# EAGLE design IARC_GR_Shield (EAGLE 6.4)
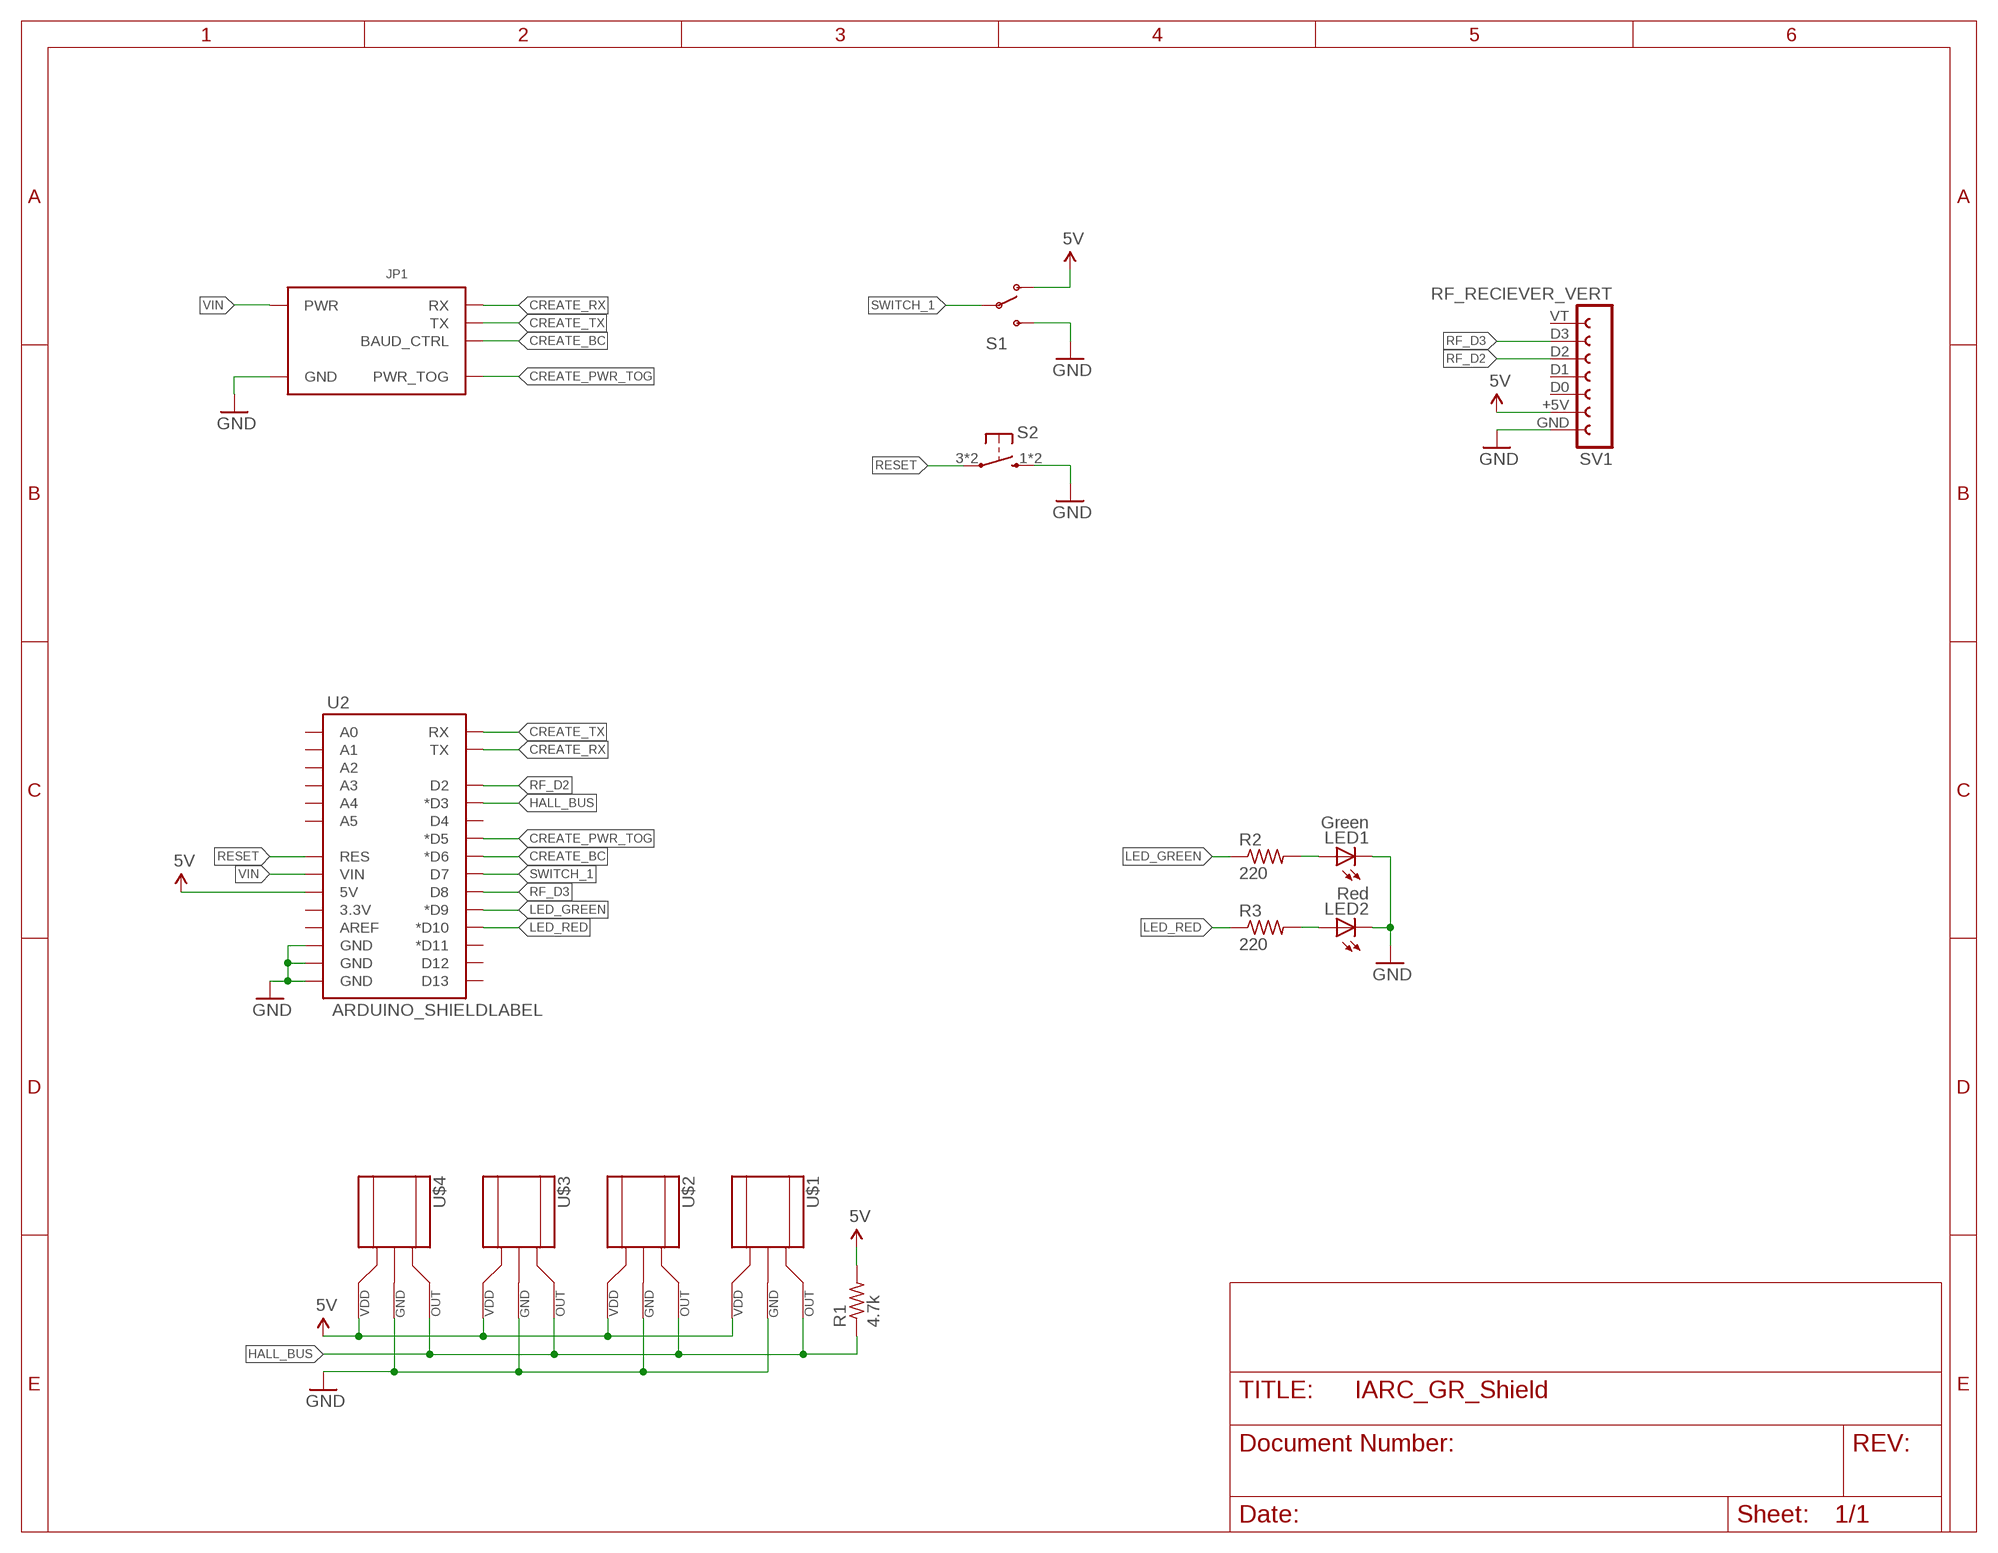
[diagram p0: schematic, sheet 1]

## Parts
JP1  IROBOT_CREATE_IARC_HOOKUP  [2X5-SHROUDED]
LED1  Green  LED5MM  [LED5MM]
LED2  Red  LED5MM  [LED5MM]
R1  4.7k  R-US_0207/10  [0207/10]
R2  220  R-US_0207/10  [0207/10]
R3  220  R-US_0207/10  [0207/10]
S1  SWITCH-SPDTTHRU-VERT  [SWITCH-SPDT_THRU-VERT]
S2  TACT_BUTTON_THRU-HOLE  [SIMPLE_BUTTON]
SV1  RF_RECIEVER_VERT  [RF_RECIEVER_VERT]
U2  ARDUINO_SHIELDLABEL  [DUEMILANOVE_SHIELD]
U$1  HALL_EFFECTHEADER  [1X03]
U$2  HALL_EFFECTHEADER  [1X03]
U$3  HALL_EFFECTHEADER  [1X03]
U$4  HALL_EFFECTHEADER  [1X03]

## Nets
5V: R1.2 S1.1(O) SV1.+5V U2.5V U$1.1(VDD) U$2.1(VDD) U$3.1(VDD) U$4.1(VDD)
CREATE_BC: JP1.3(BAUD_CTRL) U2.D6(*D6)
CREATE_PWR_TOG: JP1.5(PWR_TOG) U2.D5(*D5)
CREATE_RX: JP1.4(RX) U2.TX
CREATE_TX: JP1.1(TX) U2.RX
GND: JP1.2(GND) LED1.K(C) LED2.K(C) S1.3(S) S2.1(S) S2.2(S) SV1.GND U2.GND@0(GND) U2.GND@1(GND) U2.GND@2(GND) U$1.2(GND) U$2.2(GND) U$3.2(GND) U$4.2(GND)
HALL_BUS: R1.1 U2.D3(*D3) U$1.3(OUT) U$2.3(OUT) U$3.3(OUT) U$4.3(OUT)
LED_GREEN: R2.1 U2.D9(*D9)
LED_RED: R3.1 U2.D10(*D10)
N$1: LED1.A R2.2
N$2: LED2.A R3.2
RESET: S2.3(P) S2.4(P) U2.RES
RF_D2: SV1.D2 U2.D2
RF_D3: SV1.D3 U2.D8
SWITCH_1: S1.2(P) U2.D7
VIN: JP1.6(PWR) U2.VIN
Unconnected: SV1.D0 SV1.D1 SV1.VT U2.3.3V U2.A0 U2.A1 U2.A2 U2.A3 U2.A4 U2.A5 U2.AREF U2.D4 U2.D11(*D11) U2.D12 U2.D13

## Library data of the parts
JP1 = MAAV_Roomba:IROBOT_CREATE_IARC_HOOKUP: 0.1" spaced headers
LED1 LED2 = SparkFun:LED: LEDs Standard schematic elements and footprints for 5mm, 3mm, 1206, and 0603 sized LEDs. 5mm - Spark Fun Electronics SKU : COM-00529 (and others)
R1-R3 = rcl:R-US_: RESISTOR, American symbol
S1 = MAAV_Roomba:SWITCH-SPDT: SPDT Switch Simple slide switch; DIGIKEY#: EG1903-ND; MANUFACTURER-PN: EG1218; SPARKFUN#: COM-00102
S2 = MAAV_Roomba:TACT_BUTTON: OMRON SWITCH; MPN: B3F-1000; OC_FARNELL: 176432; OC_NEWARK: 36M3542
SV1 = MAAV_Roomba:RF_RECIEVER: FEMALE HEADER; DIGIKEY#: S7005-ND; MF: Sulins; MPN: PPTC071LFBN-RC
U2 = MAAV_Roomba:ARDUINO_SHIELD: Arduino shield footprint
U$1-U$4 = MAAV_Roomba:HALL_EFFECT

## Board
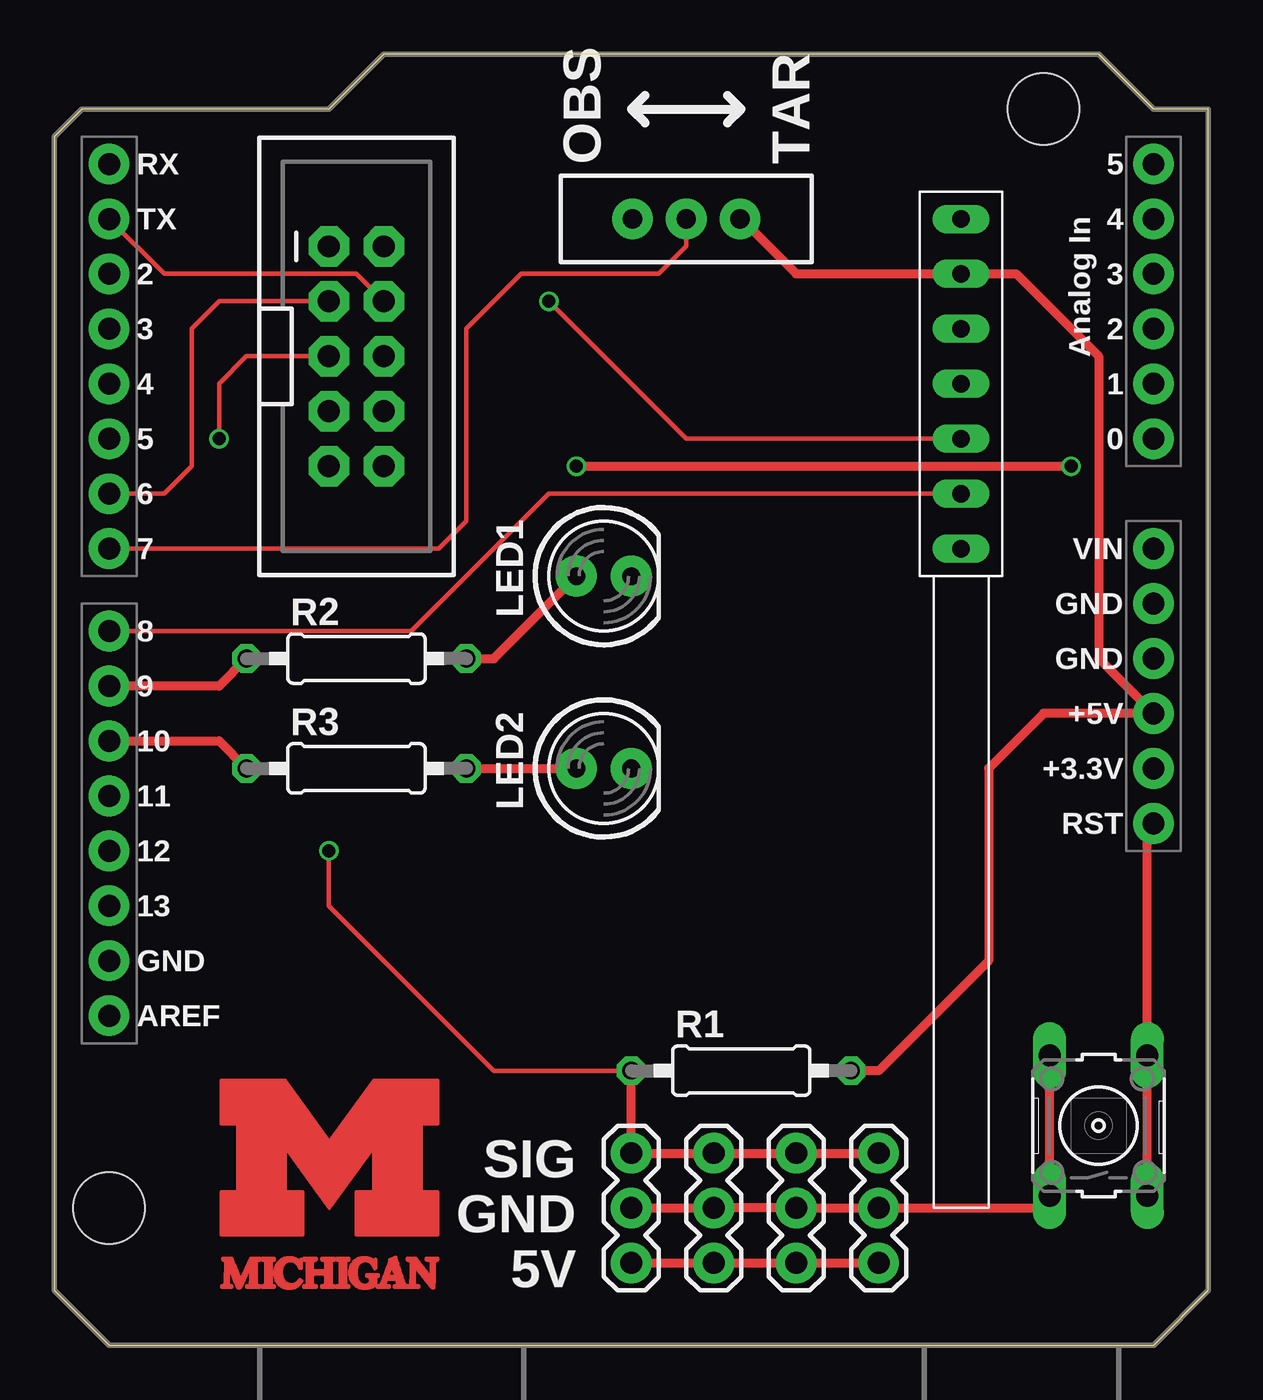
[diagram p1: board, top side]
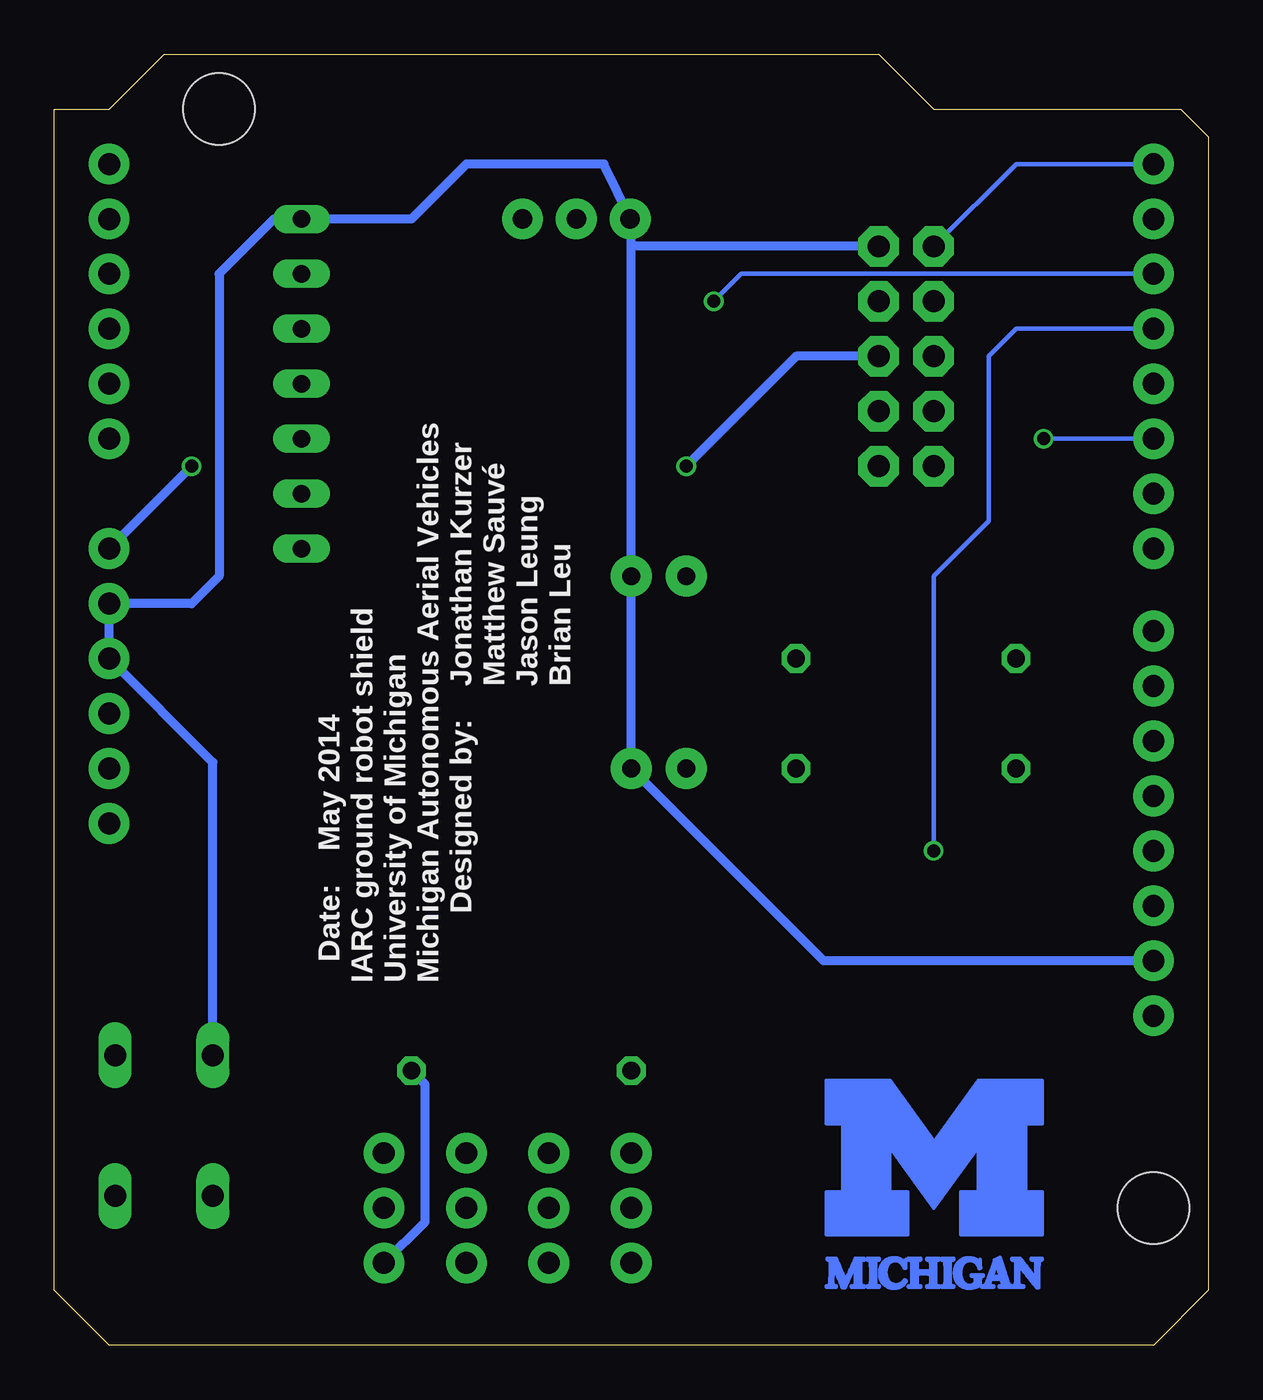
[diagram p2: board, bottom side, seen from below]

Size 53.34 x 59.69 mm. Coordinates in mm from the lower left corner, seen from the top.
Outline: 0,2.54 2.54,0 50.8,0 53.34,2.54 53.34,57.15 50.8,57.15 48.26,59.69 15.24,59.69 12.7,57.15 1.27,57.15 0,55.88 0,2.54
Copper layers (1*16): Top 0.035mm / dielectric 1.5mm / Bottom 0.035mm
Design rules "ITEADstudio_2-layer_DRC": minimum track width 6mil, minimum drill 12mil, track to track 6mil, track to pad 6mil, pad to pad 6mil, via to via 6mil, smd to smd 0mil, copper to edge 10mil, drill to drill 10mil, minimum pad ring 10mil, minimum via ring 6mil, stop-mask expansion 2mil, vias tented up to drill 100mil, thermal gap 10mil

### Footprints (pad centres in the part's own frame; a part is rotated, then mirrored left to right if it is on the bottom)
2X5-SHROUDED = drill 1.016 pad 1.88 octagon: 1 -1.27,5.08; 2 1.27,5.08; 3 -1.27,2.54; 4 1.27,2.54; 5 -1.27,0; 6 1.27,0; 7 -1.27,-2.54; 8 1.27,-2.54; 9 -1.27,-5.08; 10 1.27,-5.08
LED5MM = drill 0.813 pad 1.88: A -1.27,0; K 1.27,0
0207/10 = drill 0.813 octagon: 1 -5.08,0; 2 5.08,0
SWITCH-SPDT_THRU-VERT = drill 0.9 pad 1.88: 1 0,2.489; 2 0,0; 3 0,-2.489
SIMPLE_BUTTON = drill 1.016 long: 1 -3.251,2.261; 2 3.251,2.261; 3 -3.251,-2.261; 4 3.251,-2.261
RF_RECIEVER_VERT = drill 0.813 long: +5V 5.08,0; D0 2.54,0; D1 0,0; D2 -2.54,0; D3 -5.08,0; GND 7.62,0; VT -7.62,0
DUEMILANOVE_SHIELD = drill 1.016 pad 1.88: 3.3V 50.8,26.67; 5V 50.8,29.21; A0 50.8,41.91; A1 50.8,44.45; A2 50.8,46.99; A3 50.8,49.53; A4 50.8,52.07; A5 50.8,54.61; AREF 2.54,15.24; D2 2.54,49.53; D3 2.54,46.99; D4 2.54,44.45; D5 2.54,41.91; D6 2.54,39.37; D7 2.54,36.83; D8 2.54,33.02; D9 2.54,30.48; D10 2.54,27.94; D11 2.54,25.4; D12 2.54,22.86; D13 2.54,20.32; GND@0 50.8,31.75; GND@1 50.8,34.29; GND@2 2.54,17.78; RES 50.8,24.13; RX 2.54,54.61; TX 2.54,52.07; VIN 50.8,36.83 | hole 3.302: 45.72,57.15; 2.54,6.35
1X03 = drill 1.016 pad 1.88: 1 0,0; 2 2.54,0; 3 5.08,0

### Placement (x,y rotation side)
JP1  13.97,45.72 0 top
LED1  25.4,35.56 0 top
LED2  25.4,26.67 0 top
R1  31.75,12.7 0 top
R2  13.97,31.75 0 top
R3  13.97,26.67 0 top
S1  29.21,52.07 270 top
S2  48.26,10.16 90 top
SV1  41.91,44.45 90 top
U2  0,0 0 top
U$1  26.67,3.81 90 top
U$2  30.48,3.81 90 top
U$3  34.29,3.81 90 top
U$4  38.1,3.81 90 top
U$12  [BLOCK-M-STACKED_10MM_MASK]  12.7,6.35 0 top
U$13  [BLOCK-M-STACKED_10MM_MASK]  12.7,6.35 0 bottom

### Tracks (layer width: path | path; a pad name or v marks a point on that pad's centre or on a via)
5V
  Top 0.406: U$1.1 U$2.1 U$3.1 U$4.1 | S1.1 31.7,52.12 34.29,49.53 SV1.+5V 44.45,49.53 48.26,45.72 48.26,31.75 U2.5V 45.72,29.21 43.18,26.67 43.18,17.78 38.1,12.7 R1.2
  Bottom 0.406: U$4.1 36.2,5.71 36.2,12.06 R1.2
CREATE_BC
  Top 0.203: U2.D6 5.08,39.37 6.35,40.64 6.35,46.99 7.62,48.26 JP1.3
CREATE_PWR_TOG  (via drill 0.6)
  Top 0.203: v7.62,41.91 7.62,44.45 8.89,45.72 JP1.5
  Bottom 0.203: U2.D5 v7.62,41.91
CREATE_RX
  Top 0.203: U2.TX 5.08,49.53 13.97,49.53 JP1.4
CREATE_TX
  Bottom 0.203: U2.RX 8.89,54.61 JP1.1
GND
  Top 0.406: U$1.2 U$2.2 U$3.2 U$4.2 45.44,6.35 S2.1 S2.2
  Bottom 0.406: S2.2 46,26.95 U2.GND@0 U2.GND@1 46.99,34.29 45.72,35.56 45.72,49.53 43.18,52.07 SV1.GND 36.83,52.07 34.29,54.61 27.94,54.61 26.67,52.02 | S1.3 26.67,52.02 | 26.67,50.8 LED1.K LED2.K 17.78,17.78 U2.GND@2 | 26.67,50.8 26.67,52.02 | JP1.2 26.67,50.8
HALL_BUS  (via drill 0.6)
  Top 0.203: v12.7,22.86 12.7,20.32 20.32,12.7 R1.1
  Top 0.406: U$4.3 U$3.3 U$2.3 U$1.3 R1.1
  Bottom 0.203: U2.D3 8.89,46.99 10.16,45.72 10.16,38.1 12.7,35.56 v12.7,22.86
LED_GREEN
  Top 0.406: R2.1 7.62,30.48 U2.D9
LED_RED
  Top 0.406: U2.D10 7.62,27.94 R3.1
N$1
  Top 0.406: R2.2 20.32,31.75 LED1.A
N$2
  Top 0.406: R3.2 LED2.A
RESET
  Top 0.406: S2.3 S2.4 50.52,23.85 U2.RES
RF_D2  (via drill 0.6)
  Top 0.203: v22.86,48.26 29.21,41.91 SV1.D2
  Bottom 0.203: U2.D2 21.59,49.53 v22.86,48.26
RF_D3
  Top 0.203: U2.D8 16.51,33.02 22.86,39.37 SV1.D3
SWITCH_1
  Top 0.203: S1.2 29.21,50.8 27.94,49.53 21.59,49.53 19.05,46.99 19.05,38.1 17.78,36.83 U2.D7
VIN  (via drill 0.6)
  Top 0.406: v24.13,40.64 v46.99,40.64
  Bottom 0.406: JP1.6 19.05,45.72 v24.13,40.64 | v46.99,40.64 U2.VIN

### Text on the board
tPlace: OBS | TAR | SIG | GND | 5V
bPlace: Brian Leu | Jason Leung | Matthew Sauvé | Jonathan Kurzer | Designed by: | May 2014 | Date: | Michigan Autonomous Aerial Vehicles | University of Michigan | IARC ground robot shield